# Altium schematic sheet BQ2057_锂电池充电.SchDoc
size A4; DocumentNumber: 29; SheetNumber: 29; SheetTotal: 29
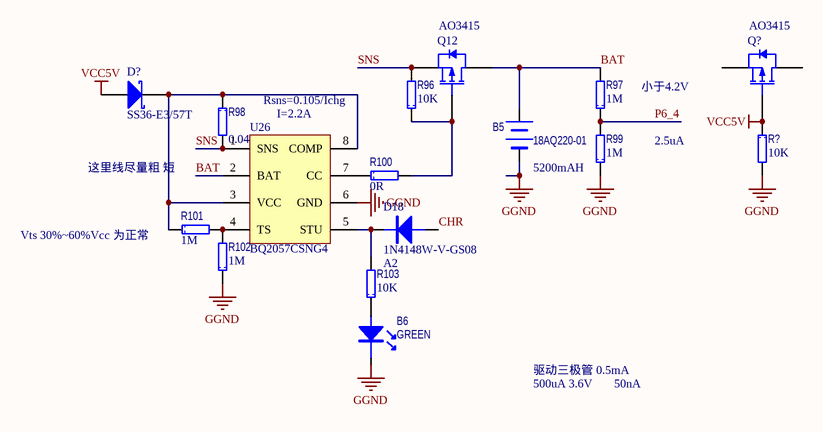
[diagram p0: BQ2057_锂电池充电.SchDoc]

## Parts
B5  18AQ220-01  volume: 5200mAH  [HDR1X3]
B6  GREEN  [0805LED]
D18  1N4148W-V-GS08  value A2  [SOD323]
D?  SS36-E3/57T  [DO-214AB/SMC]
Q12  AO3415  [SOT23_N]
Q?  AO3415  [SOT23_N]
R96  value 10K  [1608[0603]R]  (hidden comment: CRCW060310K0FKEA)
R97  value 1M  [1608[0603]R]  (hidden comment: CRCW06031M00FKEA)
R98  value 0.047R  [2012[0805]]  (hidden comment: WSL0805R0470FEK)
R99  value 1M  [1608[0603]R]  (hidden comment: CRCW06031M00FKEA)
R100  value 0R  [1608[0603]R]  (hidden comment: CRCW06030000ZSTA)
R101  value 1M  [1608[0603]R]  (hidden comment: CRCW06031M00FKEA)
R102  value 1M  [1608[0603]R]  (hidden comment: CRCW06031M00FKEA)
R103  value 10K  [1608[0603]R]  (hidden comment: CRCW060310K0FKEA)
R?  value 10K  [1608[0603]R]  (hidden comment: CRCW060310K0FKEA)
U26  BQ2057CSNG4  [SOIC8_N]

## Nets
GGND: B5.2 B6.2 R99.1 R102.1 R?.2 U26.6(GND)
VCC5V: D?.1(A) Q?.1(G) R?.1
BAT: B5.1 Q12.3(D) R97.2 U26.2(BAT)
CHR: D18.1(A)
P6_4: R97.1 R99.2
SNS: Q12.2(S) R96.2 R98.2 U26.1(SNS)
NetB6_1: B6.1 R103.1
NetD18_2: D18.2(K) R103.2 U26.5(STU)
NetD?_2: D?.2(K) R98.1 R101.1 U26.3(VCC) U26.8(COMP)
NetQ12_1: Q12.1(G) R96.1 R100.2
NetR100_1: R100.1 U26.7(CC)
NetR101_2: R101.2 R102.2 U26.4(TS)

Not connected (* = marked no-connect by the designer): Q? 2(S) 3(D)

## Notes on the sheet
- Rsns=0.105/Ichg
- 小于4.2V
- 这里线尽量粗 短
- (near U26) I=2.2A
- 2.5uA
- (near R101) Vts 30%~60%Vcc 为正常
- 驱动三极管 0.5mA
- 500uA 3.6V
- 50nA

## Library data of the parts
B5 = BATTERY: 锂电池
B6 = LED: 发光管
D18 = 1N4148W: 二极管 - 通用，功率，开关 100V Io/150mA; Manufacturer: Vishay Semiconductors; 配置: Single; 工作温度范围: - 65 C to + 150 C; 封装 / 箱体: SOD-123; 封装: Reel; 产品: Switching Diodes; 正向连续电流: 0.15 A; 最大浪涌电流: 0.5 A; 安装风格: SMD/SMT; 恢复时间: 4 ns; 正向电压下降: 1.2 V; 制造商: Vishay; 最大二极管电容: 4 pF; 最大工作温度: + 150 C; 最大功率耗散: 350 mW; 最大反向漏泄电流: 5 uA; 最小工作温度: - 65 C; 标准包装数量: 15000; Supplier 1: Mouser; Supplier Part Number 1: 625-1N4148W-V; Manufacturer Part Number: 1N4148W-V-GS08; RoHS: RoHS Compliant; Description 1: 二极管 - 通用，功率，开关 100V Io/150mA; Category: 二极管 - 通用，功率，开关; Stock 1: 404148; Pricing 1: 1=0.090, 10=0.083, 50=0.072, 100=0.068, 500=0.032, 1000=0.026, 3000=0.021, 9000=0.016, 10000=0.016, 18000=0.014 (USD); 峰值反向电压: 100 V; 产品种类: Switching Diodes; RoHS - 贸泽: Y; Minimum Order Quantity: 1; Reeling: True; ComponentLink1URL: http://www.mouser.com/ds/2/427/1n4148w--240387.pdf; ComponentLink1Description: http://www.mouser.com/ds/2/427/1n4148w--240387.pdf
D? = D Schottky: 肖特基二极管与整流器 3.0 Amp 60 Volt; Manufacturer: Vishay Semiconductors; 配置: Single; 工作温度范围: - 55 C to + 150 C; 封装 / 箱体: SMC (DO-214AB); 封装: Reel; 产品: Schottky Rectifiers; 正向连续电流: 3 A; 最大浪涌电流: 100 A; 安装风格: SMD/SMT; 正向电压下降: 0.75 V; 制造商: Vishay; 最大反向漏泄电流: 500 uA; 峰值反向电压: 60 V; 标准包装数量: 850; Supplier 1: Mouser; Supplier Part Number 1: 625-SS36-E3; Manufacturer Part Number: SS36-E3/57T; RoHS: RoHS Compliant By Exemption; Description 1: 肖特基二极管与整流器 3.0 Amp 60 Volt; Category: 肖特基二极管与整流器; Stock 1: 481; Pricing 1: 1=0.280, 10=0.250, 100=0.188, 250=0.154, 500=0.144, 850=0.144, 1000=0.139, 2000=0.131 (USD); 产品种类: Schottky Rectifiers; RoHS - 贸泽: E; Minimum Order Quantity: 1; Reeling: True; ComponentLink1URL: http://www.mouser.com/ds/2/427/88751-106389.pdf; ComponentLink1Description: http://www.mouser.com/ds/2/427/88751-106389.pdf
Q12 Q? = BSH205: P-channel Enhancement Mode MOSFET; Published: 17-Sep-2003; LatestRevisionDate: 12-Dec-2006; LatestRevisionNote: IPC-7351 Footprint Added.; DatasheetVersion: Aug-1998; PackageVersion: May-1999; PackageReference: SOT23; Publisher: Altium Limited; PackageDescription: 3-Pin SOT-23 Package 0.95 mm Pitch, 2.3 mm Lead Span; ComponentLink1Description: Manufacturer Link; ComponentLink1URL: http://www.semiconductors.philips.com/; ComponentLink2Description: Datasheet; ComponentLink2URL: http://www.semiconductors.philips.com/acrobat/datasheets/BSH205_3.pdf
R96 R103 R? = RES: 厚膜电阻器 - SMD 1/10watt 10Kohms 1%; Manufacturer: Vishay / Dale; 尺寸: 0.85 mm W x 1.55 mm L x 0.45 mm H; 工作温度范围: - 55 C to + 155 C; 封装 / 箱体: 0603 (1608 metric); 封装: Reel; 功率额定值: 100 mW; 产品: Thick Film Resistors SMD; 系列: CRCW; 温度系数: 100 PPM / K; 端接类型: SMD/SMT; 电压额定值: 75 V; 制造商: Vishay; 产品种类: 0603 Thick Film Chip Resistors; 标准包装数量: 5000; 外壳代码 - in: 0603; 外壳代码 - mm: 1608; Supplier 1: Mouser; Supplier Part Number 1: 71-CRCW0603-10K-E3; Manufacturer Part Number: CRCW060310K0FKEA; RoHS: RoHS Compliant By Exemption; Category: 厚膜电阻器 - SMD; Stock 1: 0; Pricing 1: 1=0.080, 10=0.013, 100=0.010, 1000=0.008, 5000=0.005, 25000=0.004, 50000=0.003 (USD); 电阻: 10 kOhms; 容差: 1 %; RoHS - 贸泽: E; Minimum Order Quantity: 1; Reeling: True; ComponentLink1URL: http://www.mouser.com/ds/2/427/dcrcwe3-109170.pdf; ComponentLink1Description: http://www.mouser.com/ds/2/427/dcrcwe3-109170.pdf; Description 1: 厚膜电阻器 - SMD 1/10watt 10Kohms 1%
R97 R99 R101 R102 = RES: 厚膜电阻器 - SMD 1/10watt 1.0Mohms 1%; Manufacturer: Vishay / Dale; 尺寸: 0.85 mm W x 1.55 mm L x 0.45 mm H; 工作温度范围: - 55 C to + 155 C; 封装 / 箱体: 0603 (1608 metric); 封装: Reel; 功率额定值: 100 mW; 产品: Thick Film Resistors SMD; 电阻: 1 MOhms; 系列: CRCW; 温度系数: 100 PPM / K; 端接类型: SMD/SMT; 电压额定值: 75 V; 外壳代码 - in: 0603; 外壳代码 - mm: 1608; 制造商: Vishay; 产品种类: 0603 Thick Film Chip Resistors; 标准包装数量: 5000; Supplier 1: Mouser; Supplier Part Number 1: 71-CRCW0603-1.0M-E3; Manufacturer Part Number: CRCW06031M00FKEA; RoHS: RoHS Compliant By Exemption; Category: 厚膜电阻器 - SMD; Stock 1: 71394; Pricing 1: 1=0.080, 10=0.013, 100=0.010, 1000=0.008, 5000=0.005, 25000=0.004, 50000=0.003 (USD); 容差: 1 %; RoHS - 贸泽: E; Minimum Order Quantity: 1; Reeling: True; ComponentLink1URL: http://www.mouser.com/ds/2/427/dcrcwe3-109170.pdf; ComponentLink1Description: http://www.mouser.com/ds/2/427/dcrcwe3-109170.pdf; Description 1: 厚膜电阻器 - SMD 1/10watt 1.0Mohms 1%
R98 = RES: 电流传感电阻器 - SMD 1/8watt 0.047ohms 1%; Manufacturer: Vishay / Dale; 尺寸: 1.25 mm W x 2 mm L x 0.33 mm H; 工作温度范围: - 65 C to + 170 C; 封装 / 箱体: 0805 (2012 metric); 封装: Bulk; 功率额定值: 125 mW (1/8 W); 电阻: 47 mOhms; 系列: WSL; 温度系数: 75 PPM / C; 端接类型: SMD/SMT; 类型: Power Metal Strip Resistor; 外壳高度: 0.33 mm; 外壳长度: 2 mm; 外壳宽度: 1.25 mm; 制造商: Vishay; 产品种类: SMD Power Metal Strip/Current Sensing Resistors; Supplier 1: Mouser; Supplier Part Number 1: 71-WSL0805R0470FEK; Manufacturer Part Number: WSL0805R0470FEK; RoHS: RoHS Compliant; Description 1: 电流传感电阻器 - SMD 1/8watt 0.047ohms 1%; Category: 电流传感电阻器 - SMD; Stock 1: 0; Pricing 1: 1=0.980, 100=0.830, 500=0.680, 1000=0.600, 2000=0.540, 4000=0.480, 6000=0.470, 8000=0.450, 10000=0.440 (USD); 容差: 1 %; RoHS - 贸泽: Y; Minimum Order Quantity: 1; Reeling: False; ComponentLink1URL: http://www.vishay.com/doc?30100; ComponentLink1Description: http://www.vishay.com/doc?30100
R100 = RES: 厚膜电阻器 - SMD 1/10watt ZEROohm Jumper; Manufacturer: Vishay / Dale; 尺寸: 0.85 mm W x 1.55 mm L x 0.45 mm H; 工作温度范围: - 55 C to + 155 C; 封装 / 箱体: 0603 (1608 metric); 封装: Reel; 功率额定值: 100 mW; 产品: Thick Film Resistors Zero-Ohm; 电阻: 0 Ohms; 系列: CRCW; 温度系数: 200 PPM / C; 端接类型: SMD/SMT; 容差: 1 %; 电压额定值: 75 V; 外壳代码 - in: 0603; 外壳代码 - mm: 1608; 制造商: Vishay; 产品种类: 0603 Thick Film Chip Resistors; 标准包装数量: 5000; Supplier 1: Mouser; Supplier Part Number 1: 71-CRCW0603-0; Manufacturer Part Number: CRCW06030000ZSTA; RoHS: No; Category: 厚膜电阻器 - SMD; Stock 1: 44945; Pricing 1: 1=0.110, 10=0.064, 100=0.036, 1000=0.024, 5000=0.010, 10000=0.009, 25000=0.008, 50000=0.006 (USD); RoHS - 贸泽: N; Minimum Order Quantity: 1; Reeling: True; ComponentLink1URL: http://www.mouser.com/ds/2/427/dcrcw-72725.pdf; ComponentLink1Description: http://www.mouser.com/ds/2/427/dcrcw-72725.pdf; Description 1: 厚膜电阻器 - SMD 1/10watt ZEROohm Jumper
U26 = BQ2057: 电池管理 Li-Ion LDO Linear Charge Management IC; Manufacturer: Texas Instruments; 输出电流: 2000 mA; 输出电压: 4.2 V; 封装 / 箱体: SOIC-8; 封装: Tube; 安装风格: SMD/SMT; 温度监测: Yes; 电池类型: Li-Ion, Li-Poly; 最大工作温度: + 70 C; 最小工作温度: - 20 C; 工作电源电压: 18 V; 产品种类: Battery Management; 标准包装数量: 75; Supplier 1: Mouser; Supplier Part Number 1: 595-BQ2057CSNG4; Manufacturer Part Number: BQ2057CSNG4; RoHS: RoHS Compliant; Description 1: 电池管理 Li-Ion LDO Linear Charge Management IC; Category: 电池管理; Stock 1: 250; Pricing 1: 1=2.53, 10=2.03, 100=1.62, 500=1.28, 1000=1.17, 2500=1.07, 5000=1.05, 10000=0.996 (USD); 系列: BQ2057C; 制造商: Texas Instruments; 产品类型: Charge Management; RoHS - 贸泽: Y; Minimum Order Quantity: 1; Reeling: False; ComponentLink1URL: http://www.mouser.com/ds/2/405/slus025f-206086.pdf; ComponentLink1Description: http://www.mouser.com/ds/2/405/slus025f-206086.pdf